# Altium schematic sheet ATMEGA16单片机模块.SCHDOC
size A4
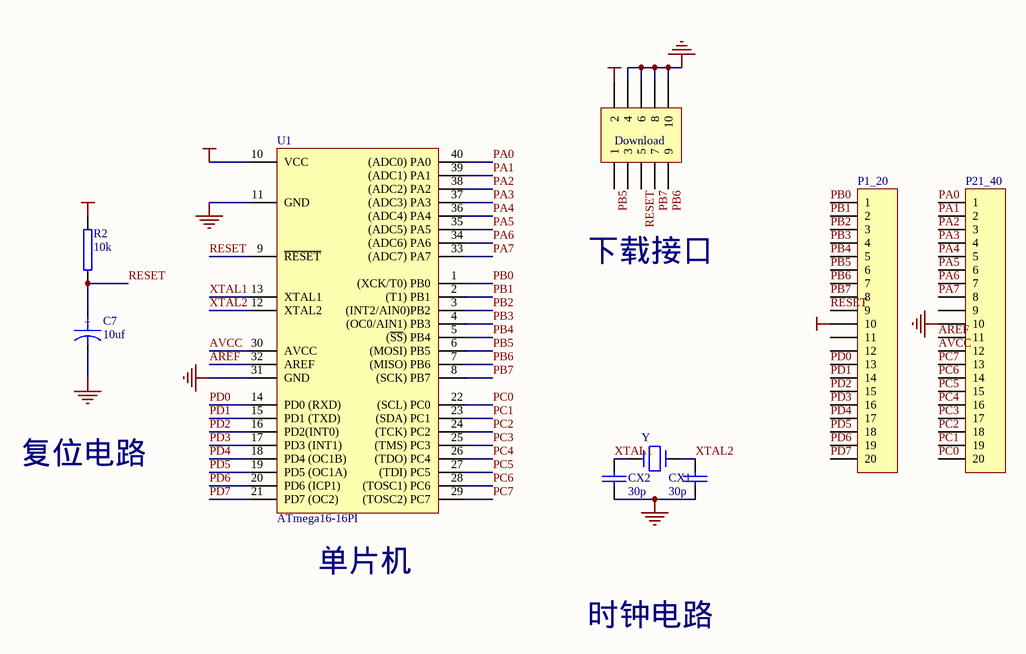
[diagram p0: ATMEGA16单片机模块.SCHDOC]

## Parts
C7  10uf  [C-DJ-4]
CX1  30p  [HDR1X2]
CX2  30p  [HDR1X2]
Download  Download  [HDR-2x5]
P1_20  PZ_20  [HDR1X20]  (value not drawn)
P21_40  PZ_20  [HDR1X20]  (value not drawn)
R2  10k  [RSE]
U1  ATmega16-16PI  [底座DIP-40/引脚15.24mm]
Y  Y  [JZ_ZC]

## Nets
GND: C7.2 CX1.2 CX2.2 Download.4 Download.6 Download.8 Download.10 P21_40.10 U1.11(GND) U1.31(GND)
VCC: Download.2 P1_20.10 R2.2 U1.10(VCC)
AREF: P21_40.11 U1.32(AREF)
AVCC: P21_40.12 U1.30(AVCC)
PA0: P21_40.1 U1.40((ADC0)_PA0)
PA1: P21_40.2 U1.39((ADC1)_PA1)
PA2: P21_40.3 U1.38((ADC2)_PA2)
PA3: P21_40.4 U1.37((ADC3)_PA3)
PA4: P21_40.5 U1.36((ADC4)_PA4)
PA5: P21_40.6 U1.35((ADC5)_PA5)
PA6: P21_40.7 U1.34((ADC6)_PA6)
PA7: P21_40.8 U1.33((ADC7)_PA7)
PB0: P1_20.1 U1.1((XCK/T0)_PB0)
PB1: P1_20.2 U1.2((T1)_PB1)
PB2: P1_20.3 U1.3((INT2/AIN0)PB2)
PB3: P1_20.4 U1.4((OC0/AIN1)_PB3)
PB4: P1_20.5 U1.5((~{SS})_PB4)
PB5: Download.1 P1_20.6 U1.6((MOSI)_PB5)
PB6: Download.9 P1_20.7 U1.7((MISO)_PB6)
PB7: Download.7 P1_20.8 U1.8((SCK)_PB7)
PC0: P21_40.20 U1.22((SCL)_PC0)
PC1: P21_40.19 U1.23((SDA)_PC1)
PC2: P21_40.18 U1.24((TCK)_PC2)
PC3: P21_40.17 U1.25((TMS)_PC3)
PC4: P21_40.16 U1.26((TDO)_PC4)
PC5: P21_40.15 U1.27((TDI)_PC5)
PC6: P21_40.14 U1.28((TOSC1)_PC6)
PC7: P21_40.13 U1.29((TOSC2)_PC7)
PD0: P1_20.13 U1.14(PD0_(RXD))
PD1: P1_20.14 U1.15(PD1_(TXD))
PD2: P1_20.15 U1.16(PD2(INT0))
PD3: P1_20.16 U1.17(PD3_(INT1))
PD4: P1_20.17 U1.18(PD4_(OC1B))
PD5: P1_20.18 U1.19(PD5_(OC1A))
PD6: P1_20.19 U1.20(PD6_(ICP1))
PD7: P1_20.20 U1.21(PD7_(OC2))
RESET: C7.1 Download.5 P1_20.9 R2.1 U1.9(~{RESET})
XTAL1: CX2.1 U1.13(XTAL1) Y.2
XTAL2: CX1.1 U1.12(XTAL2) Y.1

Not connected (* = marked no-connect by the designer): Download 3; P1_20 11 12; P21_40 9

## Notes on the sheet
- 下载接口
- 复位电路
- (near U1) 单片机
- 时钟电路
- (in symbol CAPACITOR POL) +

## Library data of the parts
C7 = CAPACITOR POL: Capacitor
CX1 CX2 = CAP: Capacitor
Download = Header 5X2: Header, 5-Pin, Dual row; Revision: 17-Jul-2002: Re-released for DXP Platform.; Publisher: Altium Limited
P1_20 P21_40 = PZ_20: 排针——20; LatestRevisionDate: 17-Jul-2002; LatestRevisionNote: Re-released for DXP Platform.; Publisher: Altium Limited
R2 = RES2
U1 = ATmega16-P: 8 位微处理器/40引脚; 子类别: 微处理器; 发布者: 磊元工作室; 发布日期: 2003年8月18日; 制造商: Atmel Corporation; 类别: 集成电路; 元件名称（国标）: 8 位微处理器; 元件名称（英文）: 8-bit Microcontroller; 特性:存储器容量: Flash：16KB ，EEPROM：512B ，RAM：1KB; 特性:定时器/计数器: 2 个 8-bit ，1 个 16-bit; 特性:模/数转换器: 8 通道 10-bit ADC; 特性:指令: 两个时钟周期的硬件乘法器
Y = CRYSTAL